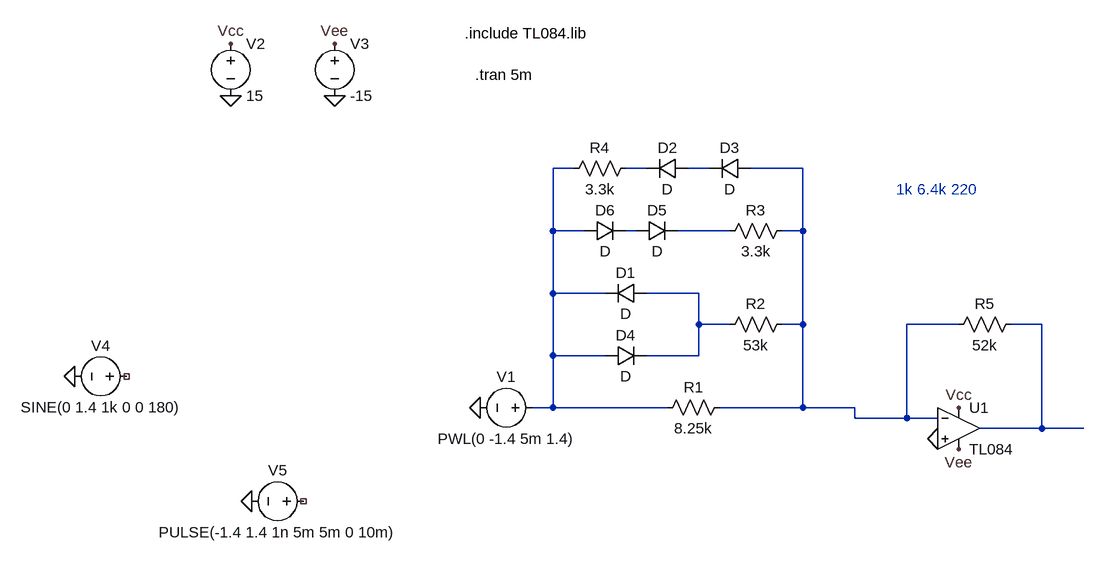
[diagram p0: schematic arthursinus.asc]
arthursinus.asc, the LTspice schematic file:
Version 4
SHEET 1 948 680
WIRE 160 -256 128 -256
WIRE 272 -256 240 -256
WIRE 368 -256 336 -256
WIRE 512 -256 432 -256
WIRE 128 -160 128 -256
WIRE 176 -160 128 -160
WIRE 256 -160 240 -160
WIRE 400 -160 320 -160
WIRE 512 -160 512 -256
WIRE 512 -160 480 -160
WIRE 128 -64 128 -160
WIRE 208 -64 128 -64
WIRE 352 -64 272 -64
WIRE 352 -16 352 -64
WIRE 400 -16 352 -16
WIRE 512 -16 512 -160
WIRE 512 -16 480 -16
WIRE 752 -16 672 -16
WIRE 880 -16 832 -16
WIRE 128 32 128 -64
WIRE 208 32 128 32
WIRE 352 32 352 -16
WIRE 352 32 272 32
WIRE 128 112 128 32
WIRE 128 112 96 112
WIRE 304 112 128 112
WIRE 512 112 512 -16
WIRE 512 112 384 112
WIRE 592 112 512 112
WIRE 592 128 592 112
WIRE 672 128 672 -16
WIRE 672 128 592 128
WIRE 720 128 672 128
WIRE 880 144 880 -16
WIRE 880 144 784 144
WIRE 944 144 880 144
FLAG 16 112 0
FLAG -368 -368 0
FLAG -208 -368 0
FLAG -368 -448 Vcc
FLAG -208 -448 Vee
FLAG 752 112 Vcc
FLAG 752 176 Vee
FLAG 720 160 0
FLAG -608 64 0
FLAG -336 256 0
SYMBOL voltage 112 112 R90
WINDOW 0 -32 56 VBottom 2
WINDOW 3 32 56 VTop 2
WINDOW 123 0 0 Left 0
WINDOW 39 0 0 Left 0
SYMATTR InstName V1
SYMATTR Value PWL(0 -1.4 5m 1.4)
SYMBOL res 400 96 R90
WINDOW 0 0 56 VBottom 2
WINDOW 3 32 56 VTop 2
SYMATTR InstName R1
SYMATTR Value 8.25k
SYMBOL res 496 -32 R90
WINDOW 0 0 56 VBottom 2
WINDOW 3 32 56 VTop 2
SYMATTR InstName R2
SYMATTR Value 53k
SYMBOL res 496 -176 R90
WINDOW 0 0 56 VBottom 2
WINDOW 3 32 56 VTop 2
SYMATTR InstName R3
SYMATTR Value 3.3k
SYMBOL res 256 -272 R90
WINDOW 0 0 56 VBottom 2
WINDOW 3 32 56 VTop 2
SYMATTR InstName R4
SYMATTR Value 3.3k
SYMBOL diode 272 -80 R90
WINDOW 0 0 32 VBottom 2
WINDOW 3 32 32 VTop 2
SYMATTR InstName D1
SYMBOL diode 336 -272 R90
WINDOW 0 0 32 VBottom 2
WINDOW 3 32 32 VTop 2
SYMATTR InstName D2
SYMBOL diode 432 -272 R90
WINDOW 0 0 32 VBottom 2
WINDOW 3 32 32 VTop 2
SYMATTR InstName D3
SYMBOL diode 208 48 R270
WINDOW 0 32 32 VTop 2
WINDOW 3 0 32 VBottom 2
SYMATTR InstName D4
SYMBOL diode 256 -144 R270
WINDOW 0 32 32 VTop 2
WINDOW 3 0 32 VBottom 2
SYMATTR InstName D5
SYMBOL diode 176 -144 R270
WINDOW 0 32 32 VTop 2
WINDOW 3 0 32 VBottom 2
SYMATTR InstName D6
SYMBOL voltage -368 -464 R0
WINDOW 123 0 0 Left 0
WINDOW 39 0 0 Left 0
SYMATTR InstName V2
SYMATTR Value 15
SYMBOL voltage -208 -464 R0
WINDOW 123 0 0 Left 0
WINDOW 39 0 0 Left 0
SYMATTR InstName V3
SYMATTR Value -15
SYMBOL Opamps\\opamp2 752 80 R0
SYMATTR InstName U1
SYMATTR Value TL084
SYMBOL res 848 -32 R90
WINDOW 0 0 56 VBottom 2
WINDOW 3 32 56 VTop 2
SYMATTR InstName R5
SYMATTR Value 52k
SYMBOL voltage -512 64 R90
WINDOW 0 -32 56 VBottom 2
WINDOW 3 32 56 VTop 2
WINDOW 123 0 0 Left 0
WINDOW 39 0 0 Left 0
SYMATTR InstName V4
SYMATTR Value SINE(0 1.4 1k 0 0 180)
SYMBOL voltage -240 256 R90
WINDOW 0 -32 56 VBottom 2
WINDOW 3 32 56 VTop 2
WINDOW 123 0 0 Left 0
WINDOW 39 0 0 Left 0
SYMATTR InstName V5
SYMATTR Value PULSE(-1.4 1.4 1n 5m 5m 0 10m)
TEXT -8 -464 Left 2 !.include TL084.lib
TEXT 8 -400 Left 2 !.tran 5m
TEXT 656 -224 Left 2 ;1k 6.4k 220

The netlist it stands for:
* arthursinus.asc
V1 N001 0 PWL(0 -1.4 5m 1.4)
R1 N004 N001 8.25k
R2 N004 N007 53k
R3 N004 N006 3.3k
R4 N002 N001 3.3k
D1 N007 N001 D
D2 N003 N002 D
D3 N004 N003 D
D4 N001 N007 D
D5 N005 N006 D
D6 N001 N005 D
V2 Vcc 0 15
V3 Vee 0 -15
XU1 0 N004 Vcc Vee N008 TL084  ; pins In+ In- V+ V- OUT
R5 N008 N004 52k
V4 NC_01 0 SINE(0 1.4 1k 0 0 180)
V5 NC_02 0 PULSE(-1.4 1.4 1n 5m 5m 0 10m)
.model D D
.lib standard.dio
.include TL084.lib
.tran 5m
* 1k 6.4k 220
.backanno
.end